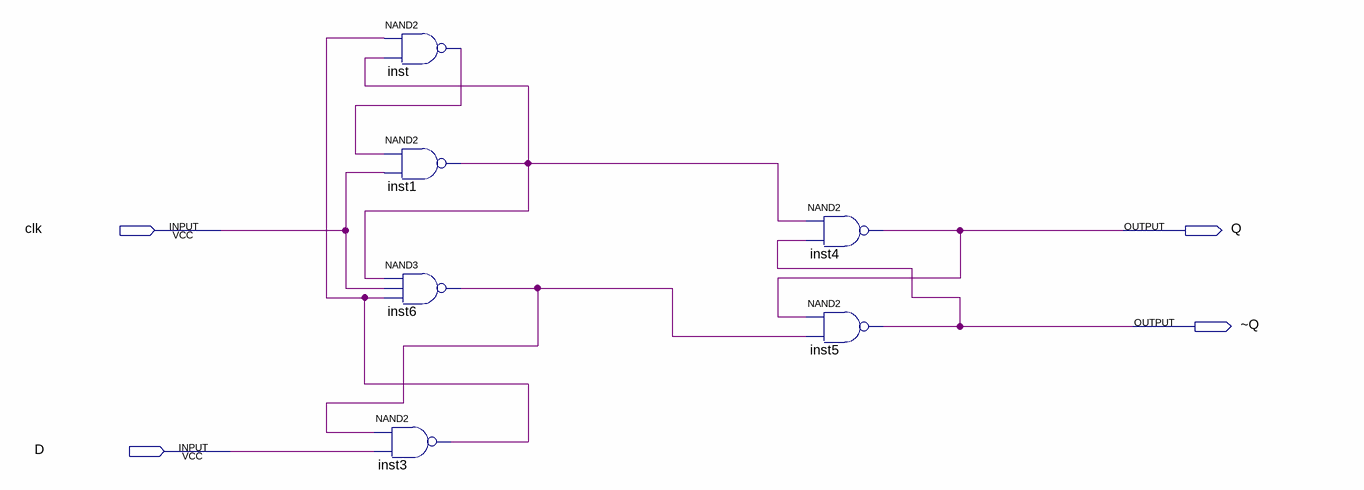
[diagram p0: schematic sheet]
// Quartus schematic step3b.bdf as structural Verilog: 6 symbols, 4 pins
module step3b (
  input  clk,
  input  D,
  output Q,
  output \~Q 
);

  wire inst1_out, inst3_out, inst6_out, inst_out;

  nand inst (inst_out, inst3_out, inst1_out);
  nand inst1 (inst1_out, inst_out, clk);
  nand inst6 (inst6_out, inst1_out, clk, inst3_out);
  nand inst3 (inst3_out, inst6_out, D);
  nand inst4 (Q, inst1_out, \~Q );
  nand inst5 (\~Q , Q, inst6_out);
endmodule
